# EAGLE schematic Atividade 3 (EAGLE 9.6.2)
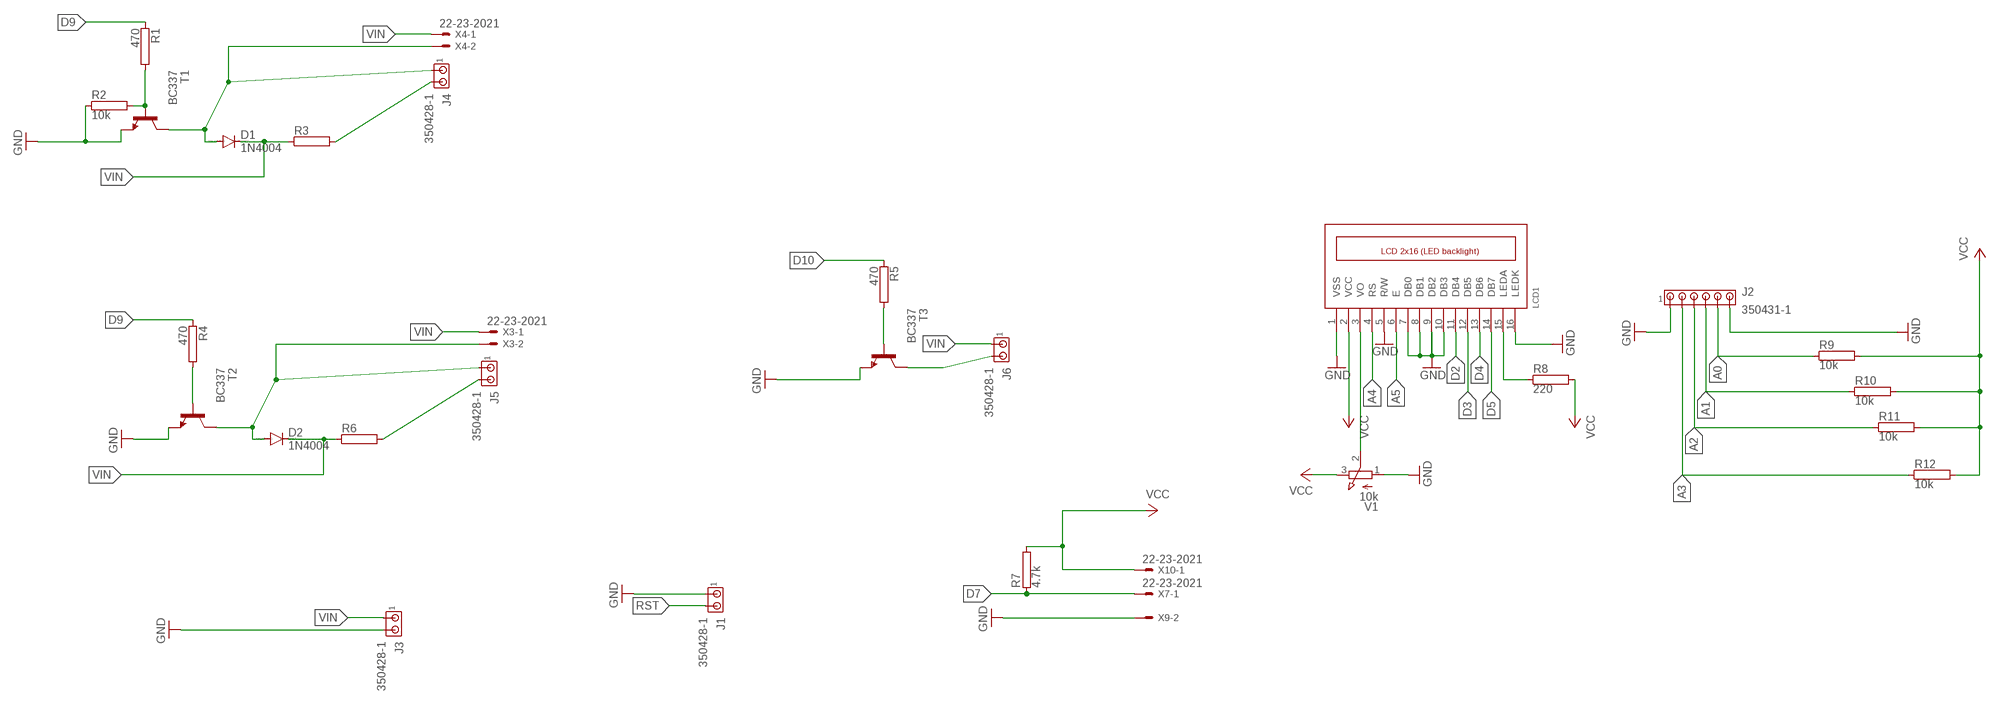
[diagram p0: schematic, sheet 1]

## Parts
D1  1N4004  [DO41-10]
D2  1N4004  [DO41-10]
J1  350428-1  [350428-1]
J2  350431-1  [350431-1]
J3  350428-1  [350428-1]
J4  350428-1  [350428-1]
J5  350428-1  [350428-1]
J6  350428-1  [350428-1]
LCD1  LCD_2X16_SIL  [HY-1602F]
R1  470  RAC03  [AC03]
R2  10k  RAC03  [AC03]
R3  RAC03  [AC03]
R4  470  RAC03  [AC03]
R5  470  RAC03  [AC03]
R6  RAC03  [AC03]
R7  4.7k  RAC03  [AC03]
R8  220  RAC03  [AC03]
R9  10k  RAC03  [AC03]
R10  10k  RAC03  [AC03]
R11  10k  RAC03  [AC03]
R12  10k  RAC03  [AC03]
T1  BC337  [TO92]
T2  BC337  [TO92]
T3  BC337  [TO92]
V1  10k  3RP/1610N  [3RP/1610N]
X3  22-23-2021  [22-23-2021]
X4  22-23-2021  [22-23-2021]
X7  22-23-2021  [22-23-2021]
X9  22-23-2021  [22-23-2021]
X10  22-23-2021  [22-23-2021]

## Nets
A0: J2.5 R9.1
A1: J2.4 R10.1
A2: J2.3 R11.1
A3: J2.2 R12.1
A4: LCD1.4(RS)
A5: LCD1.6(E)
D1: LCD1.2(VCC) R7.2 R8.2 V1.3(E) X10.1 ; supply symbol labelled VCC
D2: LCD1.11(DB4)
D3: LCD1.12(DB5)
D4: LCD1.13(DB6)
D5: LCD1.14(DB7)
D7: R7.1 X7.1
D9: R1.1 R4.1
D10: R5.1
GND: J1.1 J2.1 J2.6 J3.2 LCD1.1(VSS) R2.1 T1.1(E) T2.1(E) T3.1(E) V1.1(A) X9.2
N$1: R1.2 R2.2 T1.2(B)
N$2: J4.2 R3.2
N$4: R4.2 T2.2(B)
N$5: R5.2 T3.2(B)
N$6: J5.2 R6.2
N$7: LCD1.3(VO) V1.2(S)
N$9: LCD1.5(R/W) ; supply symbol labelled GND
N$11: LCD1.7(DB0) LCD1.8(DB1) LCD1.9(DB2) LCD1.10(DB3) ; supply symbol labelled GND
N$16: LCD1.15(LEDA) R8.1
N$17: LCD1.16(LEDK) ; supply symbol labelled GND
N$20: R9.2 R10.2 R11.2 R12.2
RST: J1.2
VIN: D1.A D1.C D2.A D2.C J3.1 J4.1 J5.1 J6.1 J6.2 R3.1 R6.1 T1.3(C) T2.3(C) T3.3(C) X3.1 X3.2 X4.1 X4.2
Unconnected: X7.2 X9.1 X10.2

## Library data of the parts
D1 D2 = diode:1N4004: DIODE general purpose rectifier, 1 A
J1 J3-J6 = con-amp:350428-1: Universal MATE-N-LOK .250" Centerline, 600 V, 19 - 36 A max Source: http://catalog.tycoelectronics.com/ .. ENG_CD_350428_Y.pdf
J2 = con-amp:350431-1: Universal MATE-N-LOK .250" Centerline, 600 V, 19 - 36 A max Source: http://catalog.tycoelectronics.com/ .. ENG_CD_350431_Y.pdf
LCD1 = lcd_2x16_led_backlight:LCD_2X16_SIL
R1-R12 = resistor-power:R: Power Resitor; OC_FARNELL: unknown; OC_NEWARK: unknown
T1-T3 = transistor:BC337: NPN TRANSISTOR
V1 = pot:3RP/1610N: 16mm Potentiometer one level Source: http://www.alphapotentiometers.net/html/16mm_pot_2.html
X3 X4 X7 X9 X10 = con-molex:22-23-2021: .100" (2.54mm) Center Header - 2 Pin; MF: MOLEX; MPN: 22-23-2021; OC_FARNELL: 1462926; OC_NEWARK: 25C3832